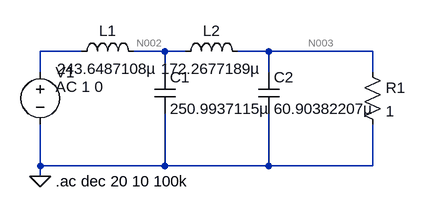
[diagram p0: schematic LPF_butterworth_4d.asc]
LPF_butterworth_4d.asc, the LTspice schematic file:
Version 4
SHEET 1 880 680
WIRE 48 192 -16 192
WIRE 176 192 128 192
WIRE 208 192 176 192
WIRE 336 192 288 192
WIRE 496 192 336 192
WIRE -16 224 -16 192
WIRE 176 224 176 192
WIRE 336 224 336 192
WIRE 496 224 496 192
WIRE -16 368 -16 304
WIRE 176 368 176 288
WIRE 176 368 -16 368
WIRE 336 368 336 288
WIRE 336 368 176 368
WIRE 496 368 496 304
WIRE 496 368 336 368
WIRE -16 384 -16 368
FLAG -16 384 0
SYMBOL ind 32 208 R270
WINDOW 0 32 56 VTop 2
WINDOW 3 5 56 VBottom 2
SYMATTR InstName L1
SYMATTR Value 243.6487108µ
SYMBOL ind 192 208 R270
WINDOW 0 32 56 VTop 2
WINDOW 3 5 56 VBottom 2
SYMATTR InstName L2
SYMATTR Value 172.2677189µ
SYMBOL cap 160 224 R0
SYMATTR InstName C1
SYMATTR Value 250.9937115µ
SYMBOL cap 320 224 R0
SYMATTR InstName C2
SYMATTR Value 60.90382207µ
SYMBOL res 480 208 R0
SYMATTR InstName R1
SYMATTR Value 1
SYMBOL voltage -16 208 R0
WINDOW 123 24 38 Left 2
SYMATTR InstName V1
SYMATTR Value ""
SYMATTR Value2 AC 1 0
TEXT 8 392 Left 2 !.ac dec 20 10 100k

The netlist it stands for:
* LPF_butterworth_4d.asc
L1 N001 N002 243.6487108µ
L2 N002 N003 172.2677189µ
C1 N002 0 250.9937115µ
C2 N003 0 60.90382207µ
R1 N003 0 1
V1 N001 0 AC 1 0
.ac dec 20 10 100k
.backanno
.end

* Results of the author's LTspice run, read from the files saved beside the schematic
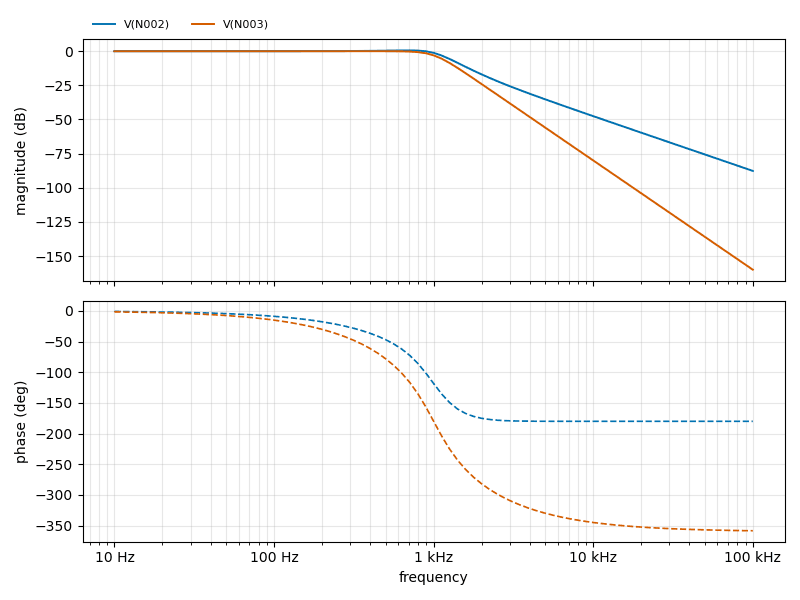
[diagram p1: AC Analysis of LPF_butterworth_4d.asc, plotted from the saved traces]
* AC Analysis, 1 run:
*   V(N002): -0.01 dB at 10 Hz, -87.65 dB at 100 kHz, peak 0.58 dB at 707.9 Hz, 3 dB below the peak at 1.075 kHz
*   V(N003): -0.02 dB at 10 Hz, -160.00 dB at 100 kHz, peak -0.01 dB at 354.8 Hz, 3 dB below the peak at 1 kHz